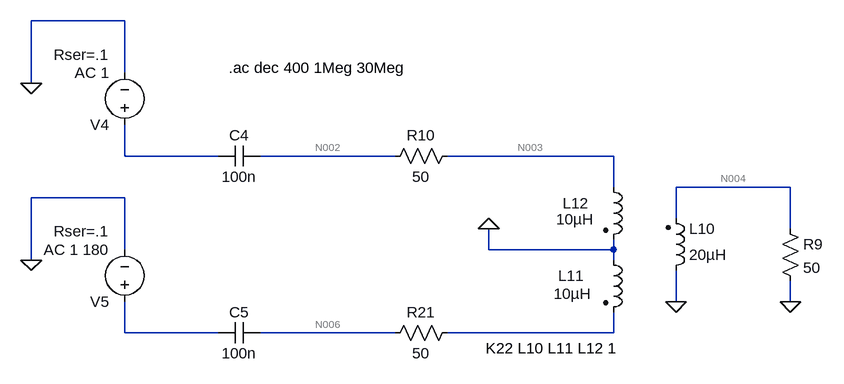
[diagram p0: schematic Tayloe Switch.asc]
Tayloe Switch.asc, the LTspice schematic file:
Version 4
SHEET 1 2848 1376
WIRE 1008 240 864 240
WIRE 1008 320 1008 240
WIRE 864 336 864 240
WIRE 1008 448 1008 400
WIRE 1152 448 1008 448
WIRE 1424 448 1216 448
WIRE 1760 448 1504 448
WIRE 1760 496 1760 448
WIRE 2032 496 1856 496
WIRE 1008 512 864 512
WIRE 1856 544 1856 496
WIRE 2032 560 2032 496
WIRE 1008 592 1008 512
WIRE 1568 592 1568 560
WIRE 1760 592 1760 576
WIRE 1760 592 1568 592
WIRE 864 608 864 512
WIRE 1760 608 1760 592
WIRE 1856 672 1856 624
WIRE 2032 672 2032 640
WIRE 1008 720 1008 672
WIRE 1152 720 1008 720
WIRE 1424 720 1216 720
WIRE 1760 720 1760 688
WIRE 1760 720 1504 720
FLAG 1856 672 0
FLAG 864 336 0
FLAG 1568 560 0
FLAG 2032 672 0
FLAG 864 608 0
SYMBOL ind2 1840 640 M180
WINDOW 0 36 80 Left 2
WINDOW 3 36 40 Left 2
SYMATTR InstName L10
SYMATTR Value 20µH
SYMATTR Type ind
SYMBOL ind2 1744 592 R0
WINDOW 0 -69 40 Left 2
WINDOW 3 -76 68 Left 2
SYMATTR InstName L11
SYMATTR Value 10µH
SYMATTR Type ind
SYMBOL ind2 1744 480 R0
WINDOW 0 -62 41 Left 2
WINDOW 3 -72 65 Left 2
SYMATTR InstName L12
SYMATTR Value 10µH
SYMATTR Type ind
SYMBOL voltage 1008 416 R180
WINDOW 123 24 96 Left 2
WINDOW 39 24 124 Left 2
WINDOW 3 46 103 Left 2
SYMATTR Value2 AC 1
SYMATTR SpiceLine Rser=.1
SYMATTR Value ""
SYMATTR InstName V4
SYMBOL cap 1216 432 R90
WINDOW 0 0 32 VBottom 2
WINDOW 3 32 32 VTop 2
SYMATTR InstName C4
SYMATTR Value 100n
SYMBOL res 2016 544 R0
SYMATTR InstName R9
SYMATTR Value 50
SYMBOL voltage 1008 688 R180
WINDOW 123 24 96 Left 2
WINDOW 39 24 124 Left 2
WINDOW 3 46 103 Left 2
SYMATTR Value2 AC 1 180
SYMATTR SpiceLine Rser=.1
SYMATTR Value ""
SYMATTR InstName V5
SYMBOL cap 1216 704 R90
WINDOW 0 0 32 VBottom 2
WINDOW 3 32 32 VTop 2
SYMATTR InstName C5
SYMATTR Value 100n
SYMBOL res 1520 432 R90
WINDOW 0 0 56 VBottom 2
WINDOW 3 32 56 VTop 2
SYMATTR InstName R10
SYMATTR Value 50
SYMBOL res 1520 704 R90
WINDOW 0 0 56 VBottom 2
WINDOW 3 32 56 VTop 2
SYMATTR InstName R21
SYMATTR Value 50
TEXT 1168 312 Left 2 !.ac dec 400 1Meg 30Meg
TEXT 1768 744 Right 2 !K22 L10 L11 L12 1

The netlist it stands for:
* Tayloe Switch.asc
L10 0 N004 20µH
L11 0 N007 10µH
L12 N003 0 10µH
V4 N001 0 AC 1 Rser=.1
C4 N002 N001 100n
R9 N004 0 50
V5 N005 0 AC 1 180 Rser=.1
C5 N006 N005 100n
R10 N003 N002 50
R21 N007 N006 50
.ac dec 400 1Meg 30Meg
K22 L10 L11 L12 1
.backanno
.end

* Results of the author's LTspice run, read from the files saved beside the schematic
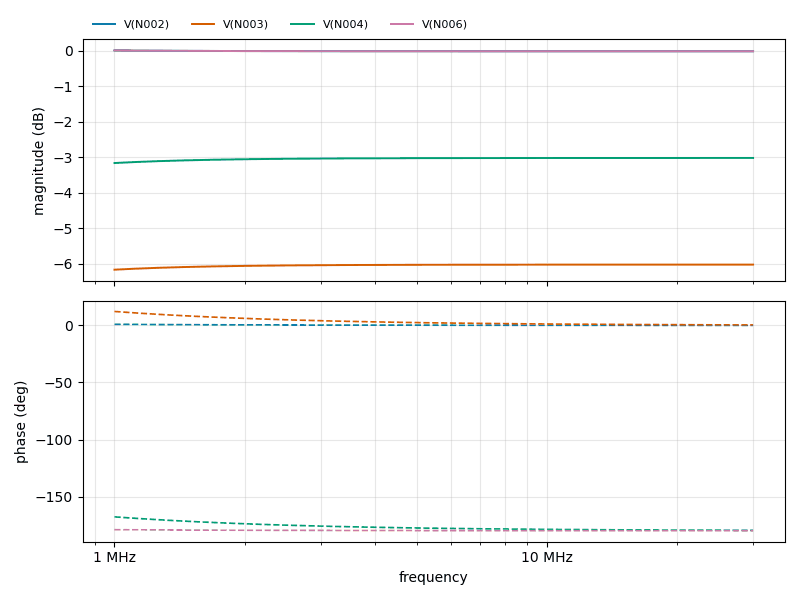
[diagram p1: AC Analysis of Tayloe Switch.asc, plotted from the saved traces]
* AC Analysis, 1 run:
*   V(N002): 0.02 dB at 1 MHz, -0.01 dB at 30 MHz, peak 0.02 dB at 1 MHz
*   V(N003): -6.17 dB at 1 MHz, -6.03 dB at 30 MHz, peak -6.03 dB at 30 MHz
*   V(N004): -3.16 dB at 1 MHz, -3.02 dB at 30 MHz, peak -3.02 dB at 30 MHz
*   V(N006): 0.02 dB at 1 MHz, -0.01 dB at 30 MHz, peak 0.02 dB at 1 MHz